# EAGLE design programmer (EAGLE 6.2)
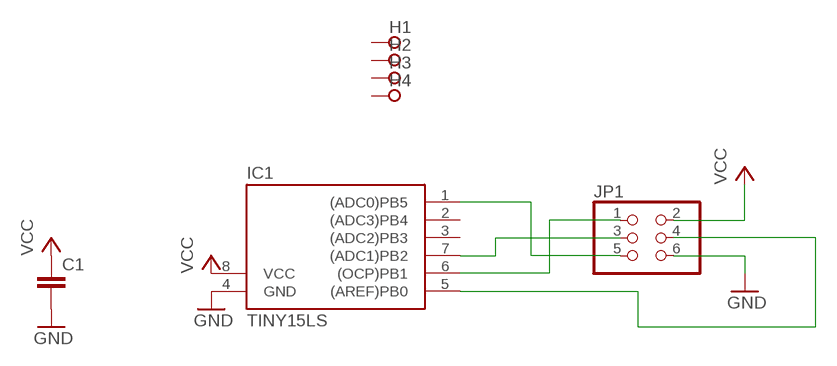
[diagram p0: schematic, sheet 1]

## Parts
C1  C-EUC1206  [C1206]
H1  SPECIAL_DRILL_0.1000  [PAD_0.1000]
H2  SPECIAL_DRILL_0.1000  [PAD_0.1000]
H3  SPECIAL_DRILL_0.1000  [PAD_0.1000]
H4  SPECIAL_DRILL_0.1000  [PAD_0.1000]
IC1  TINY15LS  [SOIC8]
JP1  PINHD-2X3  [2X03]

## Nets
GND: C1.2 IC1.4(GND) JP1.6
N$2: IC1.1((ADC0)PB5) JP1.5
N$3: IC1.6((OCP)PB1) JP1.1
N$4: IC1.5((AREF)PB0) JP1.4
N$5: IC1.7((ADC1)PB2) JP1.3
VCC: C1.1 IC1.8(VCC) JP1.2
Unconnected: H1.1 H2.1 H3.1 H4.1 IC1.2((ADC3)PB4) IC1.3((ADC2)PB3)

## Library data of the parts
C1 = rcl:C-EU: CAPACITOR, European symbol
H1-H4 = special-drill:SPECIAL_DRILL_: Special drills
IC1 = atmel:TINY15L: MICROCONTROLLER 2.7 V 1 Kbytes FLASH 64 bytes EEPROM 4-channel 10 bit ADC; OC_FARNELL: unknown; OC_NEWARK: unknown
JP1 = pinhead:PINHD-2X3: PIN HEADER

## Board
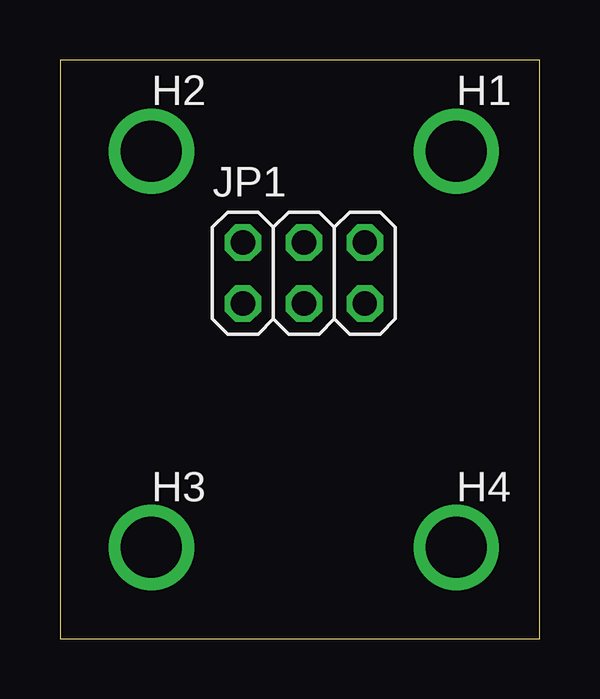
[diagram p1: board, top side]
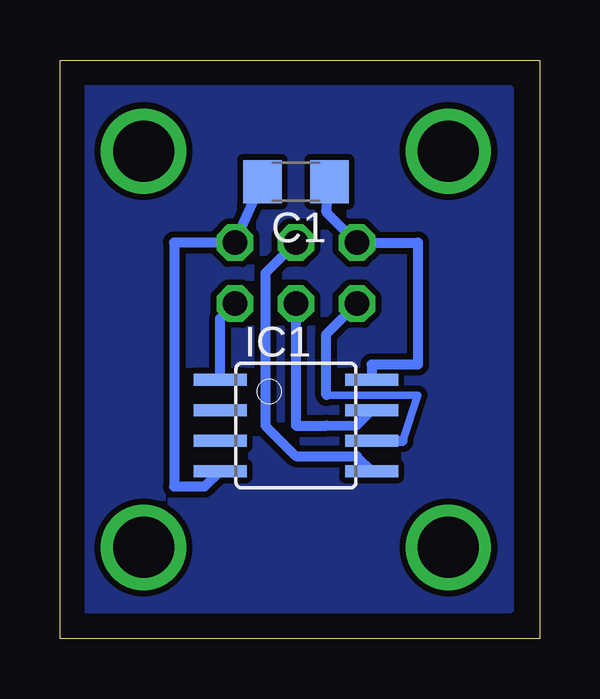
[diagram p2: board, bottom side, seen from below]

Size 19.99 x 24.12 mm. Coordinates in mm from the lower left corner, seen from the top.
Outline: 0,0 19.99,0 19.99,24.12 0,24.12 0,0
Copper layers (1*16): Top 0.035mm / dielectric 1.5mm / Bottom 0.035mm
Design rules: minimum track width 10mil, minimum drill 24mil, track to track 10mil, track to pad 10mil, pad to pad 10mil, via to via 10mil, smd to smd 8mil, copper to edge 40mil, drill to drill 8mil, minimum pad ring 10mil, minimum via ring 8mil, stop-mask expansion 4mil, vias tented up to drill 0mil, thermal gap 10mil

### Footprints (pad centres in the part's own frame; a part is rotated, then mirrored left to right if it is on the bottom)
C1206 = smd 1.6 x 1.8: 1 -1.4,0; 2 1.4,0
PAD_0.1000 = drill 2.54 pad 2.54: 1 0,0
SOIC8 = smd 0.5 x 2.2: 1 -1.905,-3.154; 2 -0.645,-3.154; 3 0.625,-3.154; 4 1.895,-3.154; 5 1.905,3.154; 6 0.635,3.154; 7 -0.635,3.154; 8 -1.905,3.154
2X03 = drill 1.016 octagon: 1 -2.54,-1.27; 2 -2.54,1.27; 3 0,-1.27; 4 0,1.27; 5 2.54,-1.27; 6 2.54,1.27

### Placement (x,y rotation side)
C1  10.16,19.05 180 bottom
H1  16.51,20.32 0 top
H2  3.81,20.32 0 top
H3  3.81,3.81 0 top
H4  16.51,3.81 0 top
IC1  10.16,8.89 270 bottom
JP1  10.16,15.24 0 top

### Tracks (layer width: path | path; a pad name or v marks a point on that pad's centre or on a via)
GND
  Bottom 0.406: C1.2 JP1.6 15.24,16.51 15.24,6.35 13.96,6.35 IC1.4
N$1
  pour Bottom: 1.27,22.86 19.05,22.86 19.05,1.27 1.27,1.27
N$2
  Bottom 0.406: IC1.1 13.31,13.36 JP1.5
N$3
  Bottom 0.305: 5.71,8.26 5.08,10.16 8.89,10.16
  Bottom 0.406: IC1.6 5.71,8.26 | 8.89,10.16 8.89,12.7 JP1.1
N$4
  Bottom 0.406: JP1.4 11.43,15.24 11.43,8.89 10.16,7.62 7.62,7.62 7.62,7.6 IC1.5
N$5
  Bottom 0.406: JP1.3 10.16,8.89 8.89,8.89 7.62,8.91 IC1.7
VCC
  Bottom 0.406: C1.1 8.89,17.78 JP1.2 5.08,16.51 5.08,11.43 7.01,11.43 IC1.8